# Altium schematic sheet 1_模块原理图.schdoc.schdoc
size 302 x 215 mm; Name: A_A4; Symbol: A_A4; Device: A_A4; @Project Name: keyboard_Tassel43; REV: 1.0; Date: 2022-06-09; Sheet: 1/1; Draw By: Sanksu; Company: Your Company; Convert to PCB: yes; Add into BOM: yes
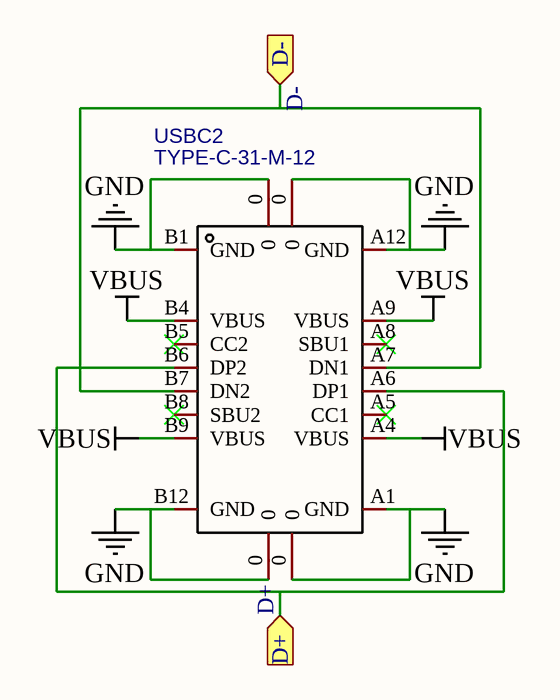
[diagram p0: 1_模块原理图.schdoc.schdoc]

## Parts
USBC2  TYPE-C-31-M-12  [USB-C_SMD-TYPE-C-31-M-12]

## Ports
D+ (in), D- (in)

## Nets
GND: USBC2.0 USBC2.A1(GND) USBC2.A12(GND) USBC2.B1(GND) USBC2.B12(GND)
VBUS: USBC2.A4(VBUS) USBC2.A9(VBUS) USBC2.B4(VBUS) USBC2.B9(VBUS)
D+: USBC2.A6(DP1) USBC2.B6(DP2) ; port D+
D-: USBC2.A7(DN1) USBC2.B7(DN2) ; port D-

Not connected (* = marked no-connect by the designer): USBC2 A5(CC1)* A8(SBU1)* B5(CC2)* B8(SBU2)*

## Notes on the sheet
- 1
- 2
- 3
- 4
- 5
- A
- B
- C
- D
- TITLE:
- keyboard_Tassel43
- REV:
- 1.0
- Date:
- Company:
- 2022-06-09
- Drawn By:
- Sanksu
- Sheet:
- 1/1

## Library data of the parts
USBC2 = TYPE-C-31-M-12: Manufacturer: RectangularConnectors-Contacts; Convert to PCB: yes; Name: TYPE-C-31-M-12; Symbol: TYPE-C-31-M-12; Device: TYPE-C-31-M-12; Supplier: LCSC; Supplier Part: C165948; Manufacturer Part: TYPE-C-31-M-12; JLCPCB Part Class: ExtendedPart; Add into BOM: yes; Origin Footprint: USB-C_SMD-TYPE-C-31-M-12